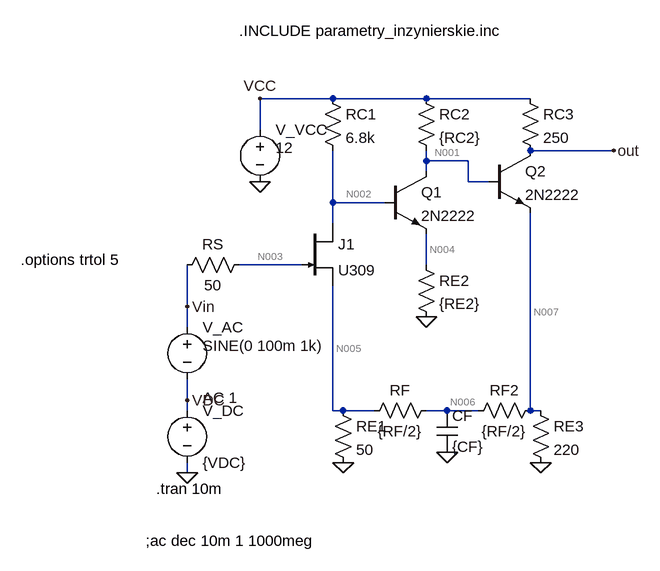
[diagram p0: schematic WSB.asc]
WSB.asc, the LTspice schematic file:
Version 4
SHEET 1 2000 680
WIRE 32 -160 -80 -160
WIRE 176 -160 32 -160
WIRE 336 -160 176 -160
WIRE -80 -112 -80 -160
WIRE 464 -80 336 -80
WIRE 176 -64 176 -80
WIRE 240 -64 176 -64
WIRE 176 -48 176 -64
WIRE 240 -32 240 -64
WIRE 272 -32 240 -32
WIRE 32 0 32 -80
WIRE 112 0 32 0
WIRE 32 32 32 0
WIRE -16 96 -112 96
WIRE 176 96 176 48
WIRE -192 160 -192 96
WIRE -192 192 -192 160
WIRE -192 304 -192 272
WIRE -192 320 -192 304
WIRE 32 320 32 128
WIRE 48 320 32 320
WIRE 96 320 48 320
WIRE 208 320 176 320
WIRE 256 320 208 320
WIRE 336 320 336 16
WIRE 352 320 336 320
WIRE -192 416 -192 400
FLAG 176 176 0
FLAG 48 400 0
FLAG 208 384 0
FLAG 352 400 0
FLAG -80 -32 0
FLAG -192 416 0
FLAG 464 -80 out
FLAG -192 160 Vin
FLAG -192 304 VDC
FLAG -80 -160 VCC
SYMBOL res 16 -176 R0
SYMATTR InstName RC1
SYMATTR Value 6.8k
SYMBOL res 160 -176 R0
SYMATTR InstName RC2
SYMATTR Value {RC2}
SYMBOL res 320 -176 R0
SYMATTR InstName RC3
SYMATTR Value 250
SYMBOL res 160 80 R0
SYMATTR InstName RE2
SYMATTR Value {RE2}
SYMBOL npn 112 -48 R0
SYMATTR InstName Q1
SYMATTR Value 2N2222
SYMBOL npn 272 -80 R0
SYMATTR InstName Q2
SYMATTR Value 2N2222
SYMBOL res 336 304 R0
SYMATTR InstName RE3
SYMATTR Value 220
SYMBOL res 32 304 R0
SYMATTR InstName RE1
SYMATTR Value 50
SYMBOL cap 192 320 R0
SYMATTR InstName CF
SYMATTR Value {CF}
SYMBOL res 192 304 R90
WINDOW 0 0 56 VBottom 2
WINDOW 3 32 56 VTop 2
SYMATTR InstName RF
SYMATTR Value {RF/2}
SYMBOL res 352 304 R90
WINDOW 0 0 56 VBottom 2
WINDOW 3 32 56 VTop 2
SYMATTR InstName RF2
SYMATTR Value {RF/2}
SYMBOL njf -16 32 R0
SYMATTR InstName J1
SYMATTR Value U309
SYMBOL res -96 80 R90
WINDOW 0 0 56 VBottom 2
WINDOW 3 32 56 VTop 2
SYMATTR InstName RS
SYMATTR Value 50
SYMBOL voltage -192 176 R0
WINDOW 123 24 124 Left 2
WINDOW 39 0 0 Left 2
WINDOW 3 24 44 Left 2
SYMATTR Value2 AC 1
SYMATTR Value SINE(0 100m 1k)
SYMATTR InstName V_AC
SYMBOL voltage -192 304 R0
WINDOW 123 0 0 Left 2
WINDOW 39 0 0 Left 2
SYMATTR InstName V_DC
SYMATTR Value {VDC}
SYMBOL voltage -80 -128 R0
WINDOW 3 24 44 Left 2
WINDOW 123 0 0 Left 2
WINDOW 39 0 0 Left 2
SYMATTR Value 12
SYMATTR InstName V_VCC
TEXT -112 -264 Left 2 !.INCLUDE parametry_inzynierskie.inc
TEXT -240 440 Left 2 !.tran 10m
TEXT -256 520 Left 2 !;ac dec 10m 1 1000meg
TEXT -448 88 Left 2 !.options trtol 5

The netlist it stands for:
* WSB.asc
RC1 VCC N002 6.8k
RC2 VCC N001 {RC2}
RC3 VCC out 250
RE2 N004 0 {RE2}
Q1 N001 N002 N004 0 2N2222
Q2 out N001 N007 0 2N2222
RE3 N007 0 220
RE1 N005 0 50
CF N006 0 {CF}
RF N006 N005 {RF/2}
RF2 N007 N006 {RF/2}
J1 N002 N003 N005 U309
RS N003 Vin 50
V_AC Vin VDC SINE(0 100m 1k) AC 1
V_DC VDC 0 {VDC}
V_VCC VCC 0 12
.model NPN NPN
.model PNP PNP
.lib standard.bjt
.model NJF NJF
.model PJF PJF
.lib standard.jft
.INCLUDE parametry_inzynierskie.inc
.tran 10m
;ac dec 10m 1 1000meg
.options trtol 5
.backanno
.end

* Results of the author's LTspice run, read from the files saved beside the schematic
* Operating Point, zero values left out:
*   V(vcc) = 12 V
*   V(n002) = 955.9 mV
*   V(n001) = 3.427 V
*   V(out) = 8.304 V
*   V(n004) = 279.1 mV
*   V(n007) = 2.698 V
*   V(n005) = 210.3 mV
*   V(n006) = 1.454 V
*   V(n003) = -1.251 V
*   V(vin) = -1.251 V
*   V(vdc) = -1.251 V
*   Ic(Q2) = 14.78 mA
*   Ib(Q2) = 73.8 µA
*   Ie(Q2) = -14.86 mA
*   Ic(Q1) = 2.298 mA
*   Ib(Q1) = 11.3 µA
*   Ie(Q1) = -2.31 mA
*   Id(J1) = 1.613 mA
*   Ig(J1) = -10.15 pA
*   Is(J1) = -1.613 mA
*   I(Rs) = 10.15 pA
*   I(Rf2) = 2.592 mA
*   I(Rf) = 2.592 mA
*   I(Re1) = 4.205 mA
*   I(Re3) = 12.27 mA
*   I(Re2) = 2.31 mA
*   I(Rc3) = 14.78 mA
*   I(Rc2) = 2.372 mA
*   I(Rc1) = 1.624 mA
*   I(V_vcc) = -18.78 mA
*   I(V_dc) = 10.15 pA
*   I(V_ac) = 10.15 pA
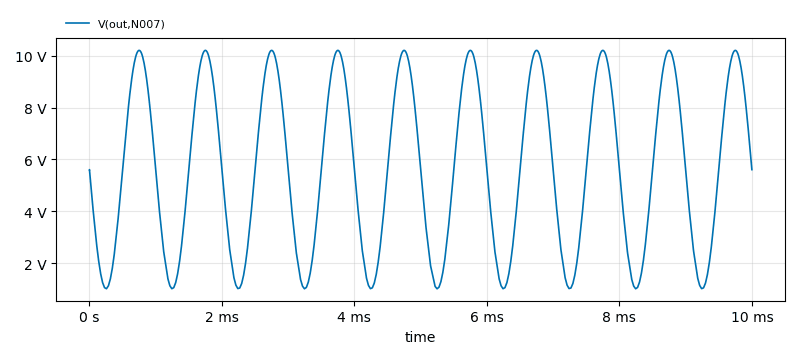
[diagram p1: Transient Analysis of WSB.asc, plotted from the saved traces]
* Transient Analysis, 1 run:
*   V(out,N007): min 1.009 V, max 10.21 V, average 5.615 V, rms 6.495 V, last 5.607 V